# Altium schematic sheet buck.SchDoc
size A1; SheetNumber: 1; SheetTotal: 1
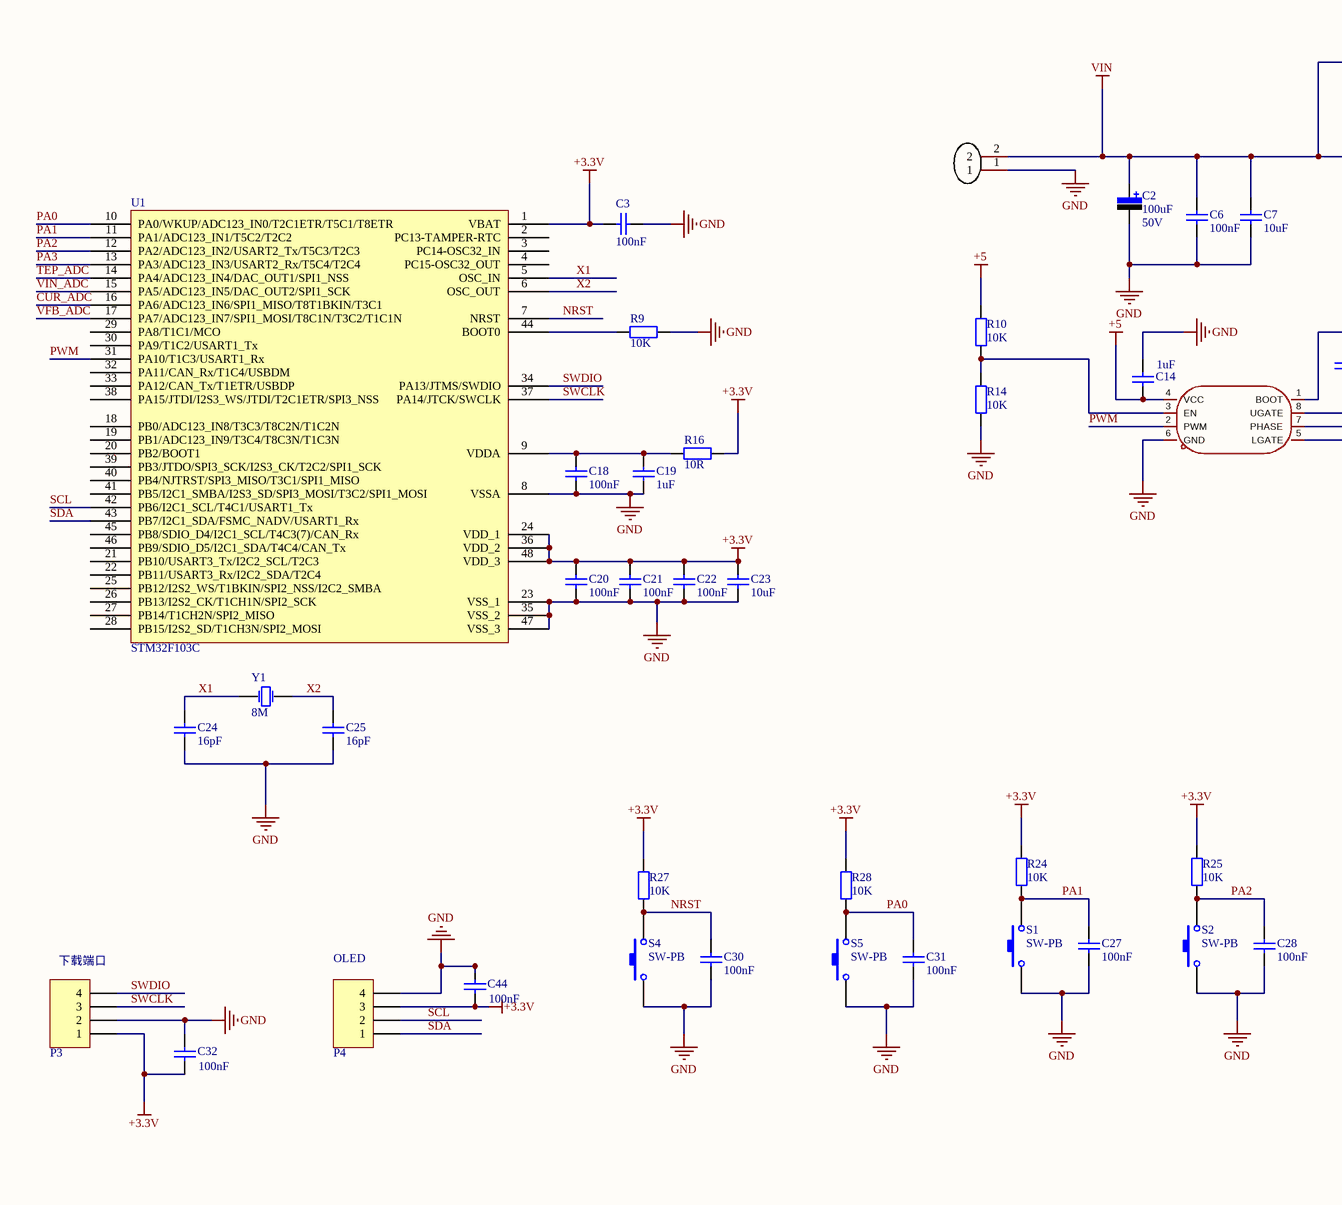
[diagram p0: buck.SchDoc, left]
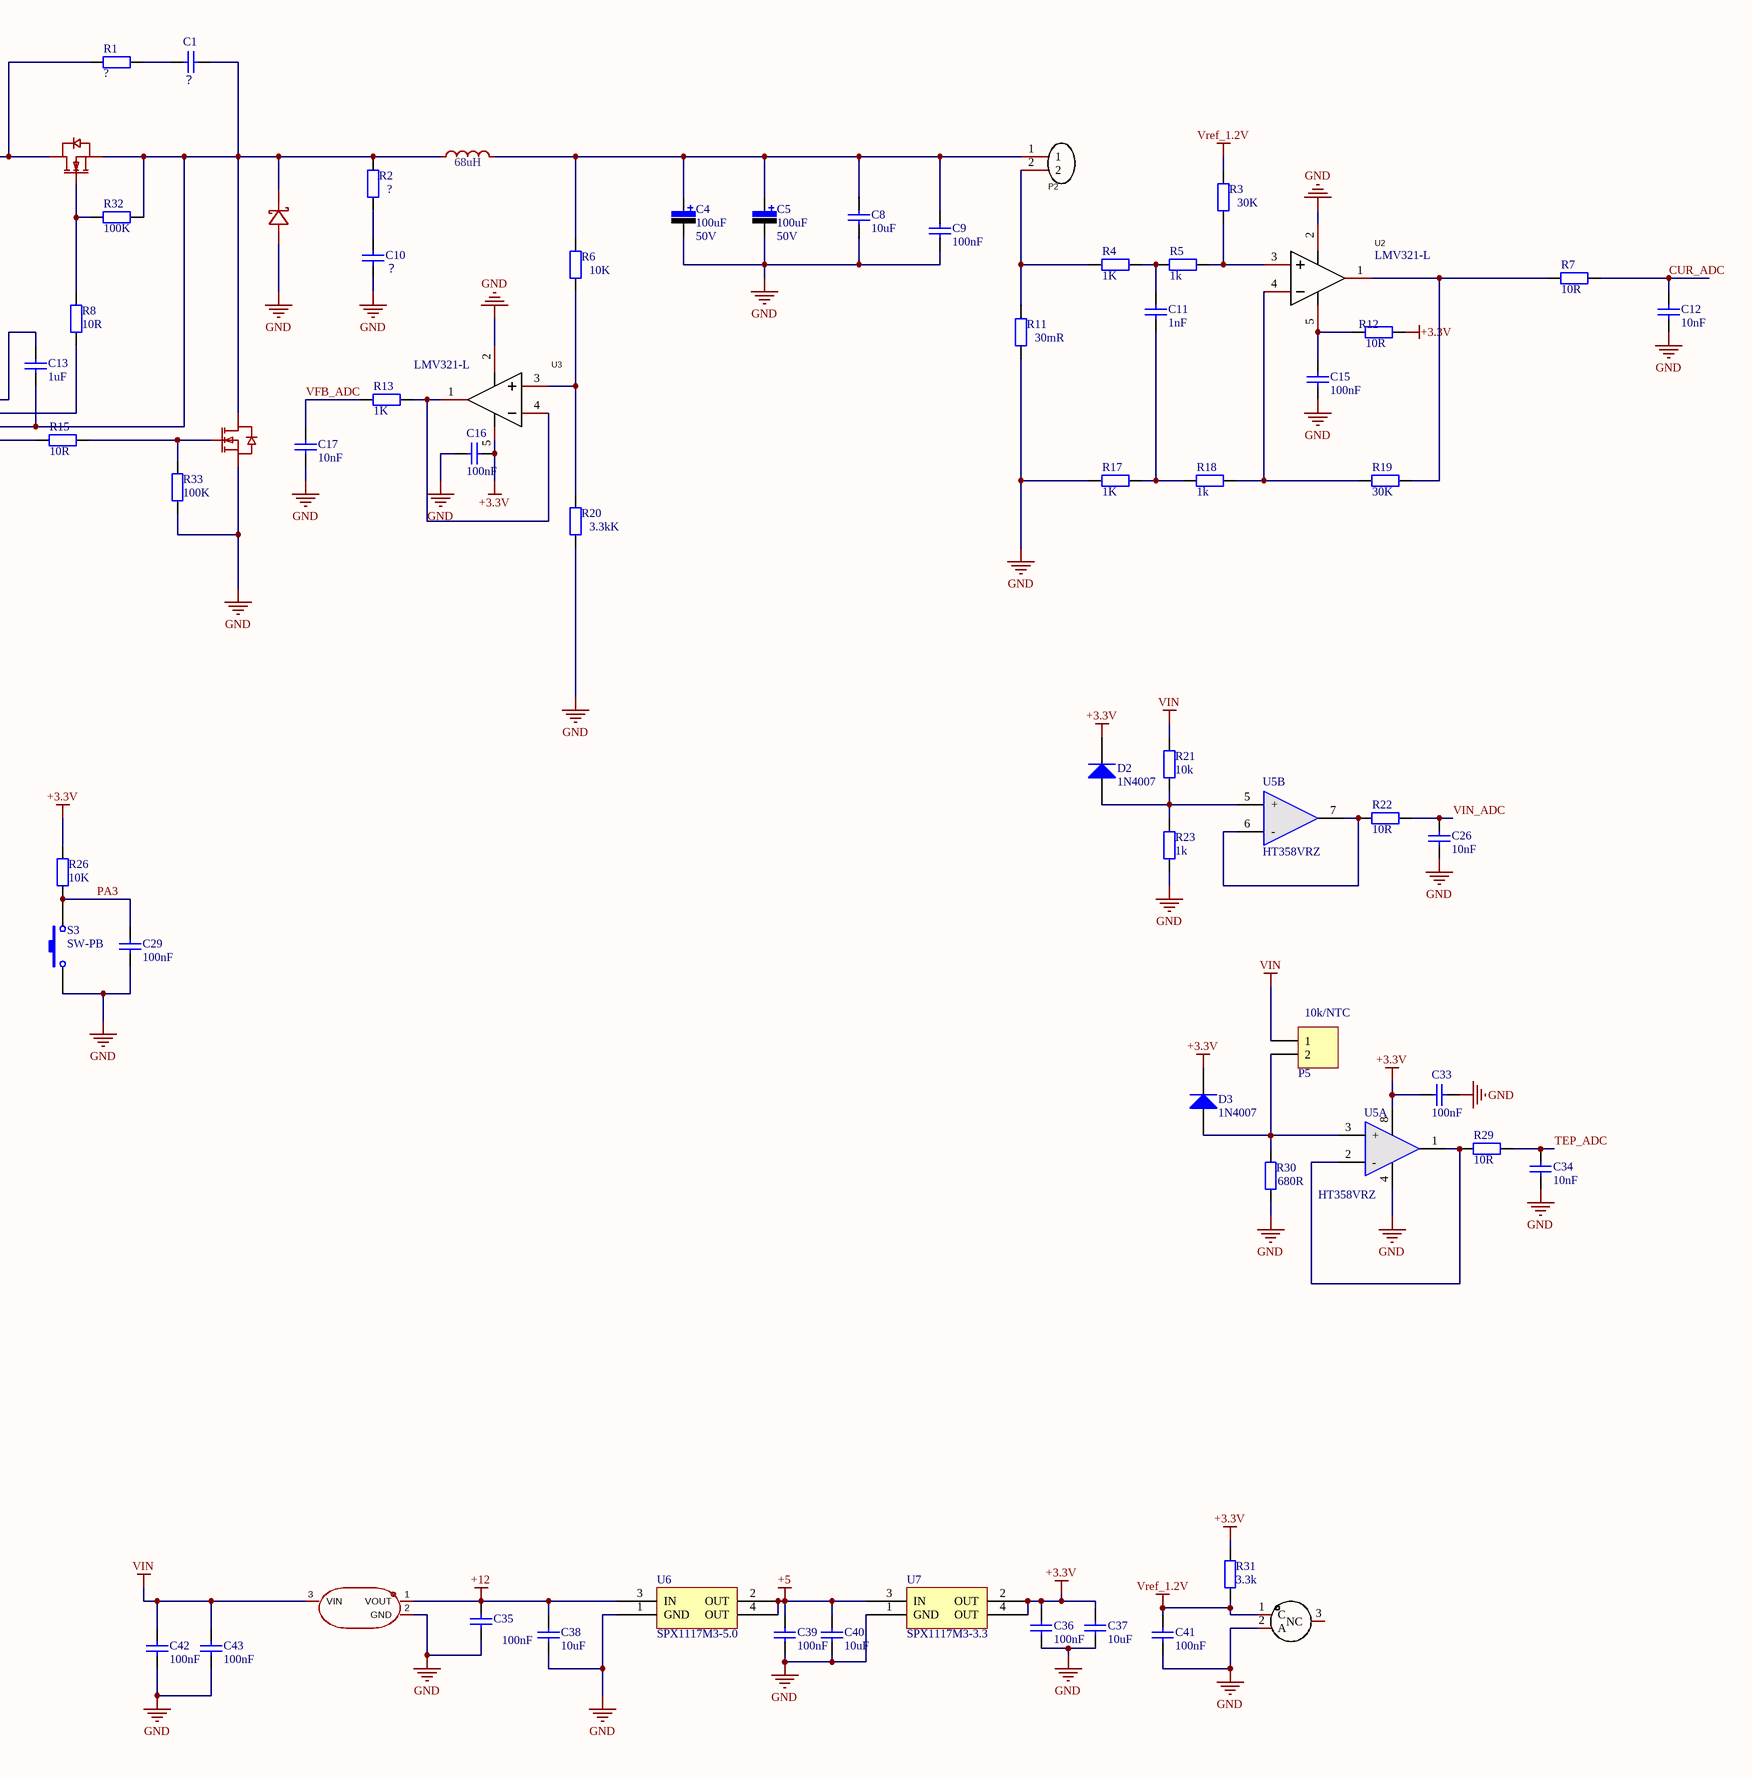
[diagram p1: buck.SchDoc, right]

## Parts
C1  ？  [C-RAD-0603]
C2  value 100uF  Vol: 50V  [CAP-TH_BD6.0-P2.50-D0.5-FD]  (hidden comment: Cap Pol)
C3  100nF  [C-RAD-0603]
C4  value 100uF  Vol: 50V  [CAP-TH_BD6.0-P2.50-D0.5-FD]  (hidden comment: Cap Pol)
C5  value 100uF  Vol: 50V  [CAP-TH_BD6.0-P2.50-D0.5-FD]  (hidden comment: Cap Pol)
C6  100nF  [C-RAD-0603]
C7  10uF  [C-RAD-0603]
C8  10uF  [C-RAD-0603]
C9  100nF  [C-RAD-0603]
C10  ？  [C-RAD-0603]
C11  1nF  [C-RAD-0603]
C12  10nF  [C-RAD-0603]
C13  1uF  [C-RAD-0603]
C14  1uF  [C-RAD-0603]
C15  100nF  [C-RAD-0603]
C16  100nF  [C-RAD-0603]
C17  10nF  [C-RAD-0603]
C18  100nF  [C-RAD-0603]
C19  1uF  [C-RAD-0603]
C20  100nF  [C-RAD-0603]
C21  100nF  [C-RAD-0603]
C22  100nF  [C-RAD-0603]
C23  10uF  [C-RAD-0603]
C24  16pF  [C-RAD-0603]
C25  16pF  [C-RAD-0603]
C26  10nF  [C-RAD-0603]
C27  100nF  [C-RAD-0603]
C28  100nF  [C-RAD-0603]
C29  100nF  [C-RAD-0603]
C30  100nF  [C-RAD-0603]
C31  100nF  [C-RAD-0603]
C32  100nF  [C-RAD-0603]
C33  100nF  [C-RAD-0603]
C34  10nF  [C-RAD-0603]
C35  100nF  [C-RAD-0603]
C36  100nF  [C-RAD-0603]
C37  10uF  [C-RAD-0603]
C38  10uF  [C-RAD-0603]
C39  100nF  [C-RAD-0603]
C40  10uF  [C-RAD-0603]
C41  100nF  [C-RAD-0603]
C42  100nF  [C-RAD-0603]
C43  100nF  [C-RAD-0603]
C44  100nF  [C-RAD-0603]
D1  ss54f_c18199179  [SMAF_L3.5-W2.6-LS4.7-RD-1]  (value not drawn)
D2  Type: 1N4007  [SMA_L4.3-W2.6-LS5.0-FD]  (hidden comment: Diode)
D3  Type: 1N4007  [SMA_L4.3-W2.6-LS5.0-FD]  (hidden comment: Diode)
L1  value 68uH  [IND-SMD_L11.5-W10.1_XR1050-680M]  (hidden comment: xr1050-680m)
P1  WJ500V-5.08-2P  [CONN-TH_2P-P5.00_WJ500V-5.08-2P]  (value not drawn)
P2  WJ500V-5.08-2P  [CONN-TH_2P-P5.00_WJ500V-5.08-2P]  (value not drawn)
P3  Header 4  [HDR4X1_A]  (value not drawn)
P4  Header 4  [HDR4X1_A]  (value not drawn)
P5  Header 2  [HDR2X1_A]  (value not drawn)
Q1  xr20n04  [TO-252-3L_L6.6-W6.1-P4.60-LS9.5-BR-CW]  (value not drawn)
Q2  xr20n04  [TO-252-3L_L6.6-W6.1-P4.60-LS9.5-BR-CW]  (value not drawn)
R1  ?  [0603-1]
R2  ?  [0603-1]
R3  30K  [0603-1]
R4  1K  [0603-1]
R5  1k  [0603-1]
R6  10K  [0603-1]
R7  10R  [0603-1]
R8  10R  [0603-1]
R9  10K  [0603-1]
R10  10K  [0603-1]
R11  30mR  [2512]
R12  10R  [0603-1]
R13  1K  [0603-1]
R14  10K  [0603-1]
R15  10R  [0603-1]
R16  10R  [0603-1]
R17  1K  [0603-1]
R18  1k  [0603-1]
R19  30K  [0603-1]
R20  3.3kK  [0603-1]
R21  10k  [0603-1]
R22  10R  [0603-1]
R23  1k  [0603-1]
R24  10K  [0603-1]
R25  10K  [0603-1]
R26  10K  [0603-1]
R27  10K  [0603-1]
R28  10K  [0603-1]
R29  10R  [0603-1]
R30  680R  [0603-1]
R31  3.3k  [0603-1]
R32  100K  [0603-1]
R33  100K  [0603-1]
S1  SW-PB  [SW_PB2_A1]
S2  SW-PB  [SW_PB2_A1]
S3  SW-PB  [SW_PB2_A1]
S4  SW-PB  [SW_PB2_A1]
S5  SW-PB  [SW_PB2_A1]
U1  STM32F103C  [LQFP-48_M]
U2  LMV321-L  [SOT-23-5_L3.0-W1.7-P0.95-LS2.8-BR]
U3  LMV321-L  [SOT-23-5_L3.0-W1.7-P0.95-LS2.8-BR]
U4  RT9624AZS  [SOP-8_L4.9-W3.9-P1.27-LS6.0-BL-1]  (value not drawn)
U5  HT358VRZ  [NSO8_N]  (parts A,B of 2)
U6  SPX1117M3-5.0  [SOT-223]
U7  SPX1117M3-3.3  [SOT-223]
U8  MG78M12N3  [SOT-89-3_L4.5-W2.5-P1.50-LS4.2-BR]  (value not drawn)
U9  LM385M3-1.2/TR  [SOT-23-3_L2.9-W1.3-P1.90-LS2.4-BR]  (value not drawn)
Y1  value 8M  [X-SM49]  (hidden comment: XTAL)

## Nets
+3.3V: C3.1 C16.2 C20.2 C21.2 C22.2 C23.2 C32.1 C33.2 C36.2 C37.2 C44.1 D2.2(K) D3.2(K) P3.1 P4.3 R12.1 R16.2 R24.2 R25.2 R26.2 R27.2 R28.2 R31.2 U1.1(VBAT) U1.24(VDD_1) U1.36(VDD_2) U1.48(VDD_3) U3.5(VCC) U5.8(V+) U7.2(OUT) U7.4(OUT)
+5: C14.1 C39.2 C40.2 R10.1 U4.4(VCC) U6.2(OUT) U6.4(OUT) U7.3(IN)
+12: C35.1 C38.2 U6.3(IN) U8.1(VOUT)
GND: C2.2 C3.2 C4.2 C5.2 C6.1 C7.1 C8.1 C9.1 C10.1 C12.1 C14.2 C15.1 C16.1 C17.2 C18.1 C19.1 C20.1 C21.1 C22.1 C23.1 C24.1 C25.1 C26.1 C27.1 C28.1 C29.1 C30.1 C31.1 C32.2 C33.1 C34.1 C35.2 C36.1 C37.1 C38.1 C39.1 C40.1 C41.1 C42.2 C43.2 C44.2 D1.2(A) P1.1 P3.2 P4.4 Q2.3(S) R9.2 R11.1 R14.2 R17.2 R20.1 R23.2 R30.2 R33.2 S1.1 S2.1 S3.1 S4.1 S5.1 U1.8(VSSA) U1.23(VSS_1) U1.35(VSS_2) U1.47(VSS_3) U2.2(GND) U3.2(GND) U4.6(GND) U5.4(V-) U6.1(GND) U7.1(GND) U8.2(GND) U9.2(A)
VIN: C2.1 C6.2 C7.2 C42.1 C43.1 P1.2 P5.1 Q1.2(D) R1.2 R21.1 U8.3(VIN)
Vref_1.2V: C41.2 R3.2 R31.1 U9.1(C)
CUR_ADC: C12.2 R7.2 U1.16(PA6/ADC123_IN6/SPI1_MISO/T8T1BKIN/T3C1)
NRST: C30.2 R27.1 S4.2 U1.7(NRST)
PA0: C31.2 R28.1 S5.2 U1.10(PA0/WKUP/ADC123_IN0/T2C1ETR/T5C1/T8ETR)
PA1: C27.2 R24.1 S1.2 U1.11(PA1/ADC123_IN1/T5C2/T2C2)
PA2: C28.2 R25.1 S2.2 U1.12(PA2/ADC123_IN2/USART2_Tx/T5C3/T2C3)
PA3: C29.2 R26.1 S3.2 U1.13(PA3/ADC123_IN3/USART2_Rx/T5C4/T2C4)
PWM: U1.31(PA10/T1C3/USART1_Rx) U4.2(PWM)
SCL: P4.2 U1.42(PB6/I2C1_SCL/T4C1/USART1_Tx)
SDA: P4.1 U1.43(PB7/I2C1_SDA/FSMC_NADV/USART1_Rx)
SWCLK: P3.3 U1.37(PA14/JTCK/SWCLK)
SWDIO: P3.4 U1.34(PA13/JTMS/SWDIO)
TEP_ADC: C34.2 R29.2 U1.14(PA4/ADC123_IN4/DAC_OUT1/SPI1_NSS)
VFB_ADC: C17.1 R13.2 U1.17(PA7/ADC123_IN7/SPI1_MOSI/T8C1N/T3C2/T1C1N)
VIN_ADC: C26.2 R22.2 U1.15(PA5/ADC123_IN5/DAC_OUT2/SPI1_SCK)
X1: C24.2 U1.5(OSC_IN) Y1.2(OSC2)
X2: C25.2 U1.6(OSC_OUT) Y1.1(OSC1)
NetC1_1: C1.1 C13.2 D1.1(K) L1.1 Q1.3(S) Q2.2(D) R2.2 R32.1 U4.7(PHASE)
NetC1_2: C1.2 R1.1
NetC4_1: C4.1 C5.1 C8.2 C9.2 L1.2 P2.1 R6.2
NetC10_2: C10.2 R2.1
NetC11_1: C11.1 R17.1 R18.2
NetC11_2: C11.2 R4.1 R5.2
NetC13_1: C13.1 U4.1(BOOT)
NetC15_2: C15.2 R12.2 U2.5(VCC)
NetC18_2: C18.2 C19.2 R16.1 U1.9(VDDA)
NetD2_1: D2.1(A) R21.2 R23.1 U5.5(+)
NetD3_1: D3.1(A) P5.2 R30.1 U5.3(+)
NetP2_2: P2.2 R4.2 R11.2
NetQ1_1: Q1.1(G) R8.2 R32.2
NetQ2_1: Q2.1(G) R15.1 R33.1
NetR3_1: R3.1 R5.1 U2.3(IN+)
NetR6_1: R6.1 R20.2 U3.3(IN+)
NetR7_1: R7.1 R19.1 U2.1(OUT)
NetR8_1: R8.1 U4.8(UGATE)
NetR9_1: R9.1 U1.44(BOOT0)
NetR10_2: R10.2 R14.1 U4.3(EN)
NetR13_1: R13.1 U3.1(OUT) U3.4(IN-)
NetR15_2: R15.2 U4.5(LGATE)
NetR18_1: R18.1 R19.2 U2.4(IN-)
NetR22_1: R22.1 U5.6(-) U5.7(OUT2)
NetR29_1: R29.1 U5.1(OUT1) U5.2(-)

Not connected (* = marked no-connect by the designer): U1 2(PC13-TAMPER-RTC) 3(PC14-OSC32_IN) 4(PC15-OSC32_OUT) 18(PB0/ADC123_IN8/T3C3/T8C2N/T1C2N) 19(PB1/ADC123_IN9/T3C4/T8C3N/T1C3N) 20(PB2/BOOT1) 21(PB10/USART3_Tx/I2C2_SCL/T2C3) 22(PB11/USART3_Rx/I2C2_SDA/T2C4) 25(PB12/I2S2_WS/T1BKIN/SPI2_NSS/I2C2_SMBA) 26(PB13/I2S2_CK/T1CH1N/SPI2_SCK) 27(PB14/T1CH2N/SPI2_MISO) 28(PB15/I2S2_SD/T1CH3N/SPI2_MOSI) 29(PA8/T1C1/MCO) 30(PA9/T1C2/USART1_Tx) 32(PA11/CAN_Rx/T1C4/USBDM) 33(PA12/CAN_Tx/T1ETR/USBDP) 38(PA15/JTDI/I2S3_WS/JTDI/T2C1ETR/SPI3_NSS) 39(PB3/JTDO/SPI3_SCK/I2S3_CK/T2C2/SPI1_SCK) 40(PB4/NJTRST/SPI3_MISO/T3C1/SPI1_MISO) 41(PB5/I2C1_SMBA/I2S3_SD/SPI3_MOSI/T3C2/SPI1_MOSI) 45(PB8/SDIO_D4/I2C1_SCL/T4C3(7)/CAN_Rx) 46(PB9/SDIO_D5/I2C1_SDA/T4C4/CAN_Tx); U9 3(NC)

## Notes on the sheet
- (near P3) 下载端口
- (near P4) OLED
- (near P5) 10k/NTC

## Library data of the parts
C1 C3 C6-C44 = Cap: 无极性电容; Published: 8-Jun-2000; LatestRevisionDate: 17-Jul-2002; LatestRevisionNote: Re-released for DXP Platform.; PackageReference: RAD-0.3; Publisher: Altium Limited
  C1 C10: Value: ？
  C3 C6 C9 C15 C16 C18 C20-C22 C27-C33 C35 C36 C39 C41-C44: Value: 100nF
  C7 C8 C23 C37 C38 C40: Value: 10uF
  C11: Value: 1nF
  C12 C17 C26 C34: Value: 10nF
  C13 C14 C19: Value: 1uF
  C24 C25: Value: 16pF
C2 C4 C5 = Cap Pol: 极性电解电容; Published: 8-Jun-2000; LatestRevisionDate: 17-Jul-2002; LatestRevisionNote: Re-released for DXP Platform.; PackageReference: RB7.6-15; Publisher: Altium Limited
D1 = SS54F: 二极管配置:独立式;正向压降(Vf):550mV@5.0A;直流反向耐压(Vr):40V;整流电流:5A;; Manufacturer: R+O(宏嘉诚); AddInBom: yes; ModelId: 4caf566195a049cf809ac17c4d641932; ModelTransform: 183.0705,102.362,0,0,0,0,0,0,0; Diode Configuration: 独立式; Voltage - DC Reverse(Vr): 40V; Current - Rectified: 5A; Reverse Leakage Current (Ir): 200uA@40V; Operating Junction Temperature Range: -55℃~+125℃; Non-Repetitive Peak Forward Surge Current: 120A; Symbol: SS54F_C18199179; LCSC Part Name: 电压:40V 电流:5A; SupplierPart: C18199179; ManufacturerPart: SS54F; Supplier Footprint: SMAF; JLCPCB Part Class: Extended Part; Datasheet: https://item.szlcsc.com/datasheet/SS54F/19354411.html; Supplier: LCSC; ConvertToPcb: yes; FootprintName: SMAF_L3.5-W2.6-LS4.7-RD-1; ModelName: SMAF_L3.5-W2.6-LS4.7-RD-1; Voltage - Forward(Vf@If): 550mV@5.0A
D2 D3 = Diode: 二极管; Published: 8-Jun-2000; LatestRevisionDate: 17-Jul-2002; LatestRevisionNote: Re-released for DXP Platform.; PackageDocument: Sep-1996; PackageReference: SMC; Publisher: Altium Limited; Code_JEDEC: DO-214-AB
L1 = xr1050-680m: 电感值:68uH;精度:±20%;额定电流:3A;饱和电流(Isat):3.8A;; Manufacturer: XR(祥如); AddInBom: yes; ModelId: 95bbcb4cdee94fed8217960e82aca4e3; ModelTransform: 452.755,398.0307,0,0,0,0,0,0,0; Tolerance: ±20%; Current Rating: 3A; Current - Saturation(Isat): 3.8A; DC Resistance(DCR): 150mΩ; Symbol: XR1050-680M; LCSC Part Name: XR1050  68uH  ±20%   3.8A; SupplierPart: C48391628; ManufacturerPart: XR1050-680M; Supplier Footprint: SMD,11.5x10.1mm; JLCPCB Part Class: Extended Part; Datasheet: https://item.szlcsc.com/datasheet/XR1050-680M/50640713.html; Supplier: LCSC; ConvertToPcb: yes; FootprintName: IND-SMD_L11.5-W10.1_XR1050-680M; ModelName: IND-SMD_L11.5-W10.1_XR1050-680M
P1 P2 = WJ500V-5.08-2P: 接线端子; Manufacturer: KANGNEX(康奈克斯电气); Symbol: WJ500V-5.08-2P-14-00A; Add into BOM: yes; Pitch: 5.08mm; Number of PINs Per Row: 2; Current Rating (Max): 18A; Voltage Rating (Max): 250V; Wire Gauge - AWG: 14~30; Wire Gauge - mm?: 2.5; Name: WJ500V-5.08-2P; Device: WJ500V-5.08-2P; LCSC Part Name: 5.08mm 排数:1 每排P数:2 直针 可拼接; Supplier Part: C8465; Manufacturer Part: WJ500V-5.08-2P; Supplier Footprint: 直插,P=5.08mm; JLCPCB Part Class: Extended Part; Datasheet: https://atta.szlcsc.com/upload/public/pdf/source/20191225/C8465_02D34CE5B5B4A53DF5891601D97FA9F4.pdf; Supplier: LCSC; Convert to PCB: yes; Number of Rows: 1; Mounting Style: 直针; Operating Temperature Range: -40℃~+105℃; Color: 绿色
P3 P4 = Header 4: 接插件; LatestRevisionDate: 17-Jul-2002; LatestRevisionNote: Re-released for DXP Platform.; Publisher: Altium Limited
P5 = Header 2: 接插件; LatestRevisionDate: 17-Jul-2002; LatestRevisionNote: Re-released for DXP Platform.; Publisher: Altium Limited
Q1 Q2 = XR20N04: 数量:1个N沟道;漏源电压(Vdss):40V;连续漏极电流(Id):20A;导通电阻(RDS(on)):40mΩ@10V;耗散功率(Pd):4W;阈值电压(Vgs(th)):2.2V;; Manufacturer: XNRUSEMI(新锐); AddInBom: yes; ModelId: 6963ffc0eb11445db0b75cbbfd87ce20; ModelTransform: 374.015,259.842,0,0,0,0,-32.638,0,0; Number: 1个N沟道; Drain to Source Voltage: 40V; Current - Continuous Drain(Id): 20A; Pd - Power Dissipation: 4W; Gate Threshold Voltage (Vgs(th)): 2.2V; Gate Charge(Qg): 11nC@10V; Input Capacitance(Ciss): 435pF; Reverse Transfer Capacitance (Crss@Vds): 35pF; Type: N沟道; Output Capacitance(Coss): 58pF; Symbol: XR20N04; LCSC Part Name: N沟道40V快速开关MOSFET; SupplierPart: C42456813; ManufacturerPart: XR20N04; Supplier Footprint: TO-252-3L; Datasheet: https://item.szlcsc.com/datasheet/XR20N04/44527903.html; Supplier: LCSC; ConvertToPcb: yes; FootprintName: TO-252-3L_L6.6-W6.1-P4.60-LS9.5-BR-CW; ModelName: TO-252-3L_L6.6-W6.1-P4.60-LS9.5-BR-CW; RDS(on): 40mΩ@10V; Operating Temperature: -55℃~+150℃
R1-R33 = Res1: 贴片电阻; Published: 8-Jun-2000; LatestRevisionDate: 17-Jul-2002; LatestRevisionNote: Re-released for DXP Platform.; PackageReference: AXIAL-0.4; Publisher: Altium Limited
  R1 R2: Value: ?
  R3 R19: Value: 30K
  R4 R13 R17: Value: 1K
  R5 R18 R23: Value: 1k
  R6 R9 R10 R14 R24-R28: Value: 10K
  R7 R8 R12 R15 R16 R22 R29: Value: 10R
  R11: Value: 30mR
  R20: Value: 3.3kK
  R21: Value: 10k
  R30: Value: 680R
  R31: Value: 3.3k
  R32 R33: Value: 100K
S1-S5 = SW-PB: 微动开关; Published: 24-Mar-1999; LatestRevisionDate: 17-Jul-2002; LatestRevisionNote: Re-released for DXP Platform.; PackageReference: SPST-2; Publisher: Altium Limited
U1 = STM32F103C: STM32单片机48引脚
U2 U3 = TLV3201AIDBVR: 比较器; Manufacturer: TI(德州仪器); Add into BOM: yes; Name: TLV3201AIDBVR; Symbol: TLV3201AIDBVR; Device: TLV3201AIDBVR; LCSC Part Name: TLV3201AIDBVR; Supplier Part: C105188; Manufacturer Part: TLV3201AIDBVR; Supplier Footprint: SOT-23-5; JLCPCB Part Class: Extended Part; Datasheet: https://atta.szlcsc.com/upload/public/pdf/source/20170919/C105188_1505787000291976628.pdf; Supplier: LCSC; Convert to PCB: yes
U4 = RT9624AZS: 驱动配置:半桥;负载类型:MOSFET;驱动通道数:2;灌电流(IOL):-;拉电流(IOH):-;工作电压:4.5V~13.2V;上升时间(tr):24ns；25ns;下降时间(tf):12ns;; Manufacturer: RICHTEK(立锜); AddInBom: yes; ModelId: 75c24a7891ee4dd6bdac16a7163ff87e; ModelTransform: 192.913,236.22,0,0,0,0,-0.393,2.749,0; Driven Configuration: 半桥; Load Type: MOSFET; Number of Drivers: 2; Fall Time: 12ns; Propagation Delay tpLH: 30ns；60ns; Propagation Delay tpHL: 22ns；8ns; Input Logic Level - High: 2.3V~3.2V; Input Logic Level - Low: 700mV~1.4V; Quiescent Current(Iq): 120uA; Symbol: RT9624AZS; LCSC Part Name: 单相同步整流降压型MOSFET驱动器; SupplierPart: C167520; ManufacturerPart: RT9624AZS; Supplier Footprint: SOP-8; JLCPCB Part Class: Extended Part; Datasheet: https://item.szlcsc.com/datasheet/RT9624AZS/178903.html; Supplier: LCSC; ConvertToPcb: yes; FootprintName: SOP-8_L4.9-W3.9-P1.27-LS6.0-BL; ModelName: SOP-8_L4.9-W3.9-P1.27-LS6.0-BL-1; Current - Output Low(IOL): -; Current - Output High(IOH): -; Voltage - Supply: 4.5V~13.2V; Rise Time: 24ns；25ns; Features: 使能关断；内置自举二极管；交错导通保护；死区时间控制; Operating Temperature: -40℃~+125℃
U5 = LM358: 双运放
U6 = SPX1117M3-5.0: 5.0V稳压芯片
U7 = SPX1117M3-3.3: 3.3V稳压芯片
U8 = MG78M12N3: 最大30V转12V，压差当电压大于3V时为1.8v，小于3V时为2.3V; Manufacturer: Megain(美佳音); AddInBom: yes; ModelId: 6db690b7897d4d18a30d90c1b89525ee; ModelName: SOT-89-3_L4.3-W2.5-H1.6-LS4.1-P1.50; ModelTransform: 161.417,169.291,0,180,0,0,-18.661,0,0; Output Configuration: 正极; Voltage - Supply: 30V; Output Voltage: 12V; Output Current: 500mA; Power Supply Rejection Ratio (PSRR): 80dB@(1kHz); Voltage Dropout: 1.8V@(500mA); standby current: 250uA; Output Type: 固定; Number of Outputs: 1; Symbol: MG78M12N3; LCSC Part Name: 12V 500mA 30V; SupplierPart: C50407967; ManufacturerPart: MG78M12N3; Supplier Footprint: SOT-89-3; JLCPCB Part Class: Extended Part; Datasheet: https://item.szlcsc.com/datasheet/MG78M12N3/53037687.html; Supplier: LCSC; ConvertToPcb: yes; FootprintName: SOT-89-3_L4.5-W2.5-P1.50-LS4.2-BR; Noise: -; Features: 过流保护；热关断; Operating Temperature: -40℃~+85℃
U9 = LM385M3-1.2/TR: Manufacturer: HGSEMI(华冠); Add into BOM: yes; Symbol: LM385M3-1.2/TR; Device: LM385M3-1.2/TR; LCSC Part Name: 1.2V 微功耗电压参考; Supplier Part: C507206; Manufacturer Part: LM385M3-1.2/TR; Supplier Footprint: SOT-23-3; JLCPCB Part Class: Extended Part; Datasheet: https://atta.szlcsc.com/upload/public/pdf/source/20200716/C507206_69C34F3D5BBAED8E3BE132CB46276FD0.pdf; Supplier: LCSC; Convert to PCB: yes
Y1 = XTAL: 晶振; Published: 8-Jun-2000; LatestRevisionDate: 17-Jul-2002; LatestRevisionNote: Re-released for DXP Platform.; PackageReference: R38; Publisher: Altium Limited